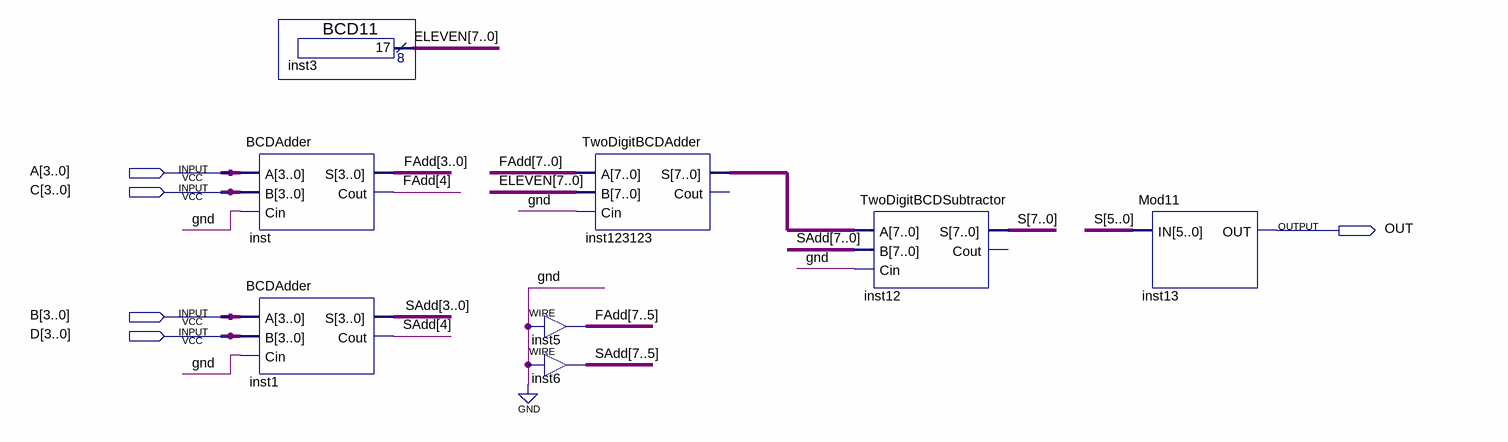
[diagram p0: schematic sheet]
// Quartus schematic FourDigitMod11.bdf as structural Verilog: 8 symbols, 5 pins
module FourDigitMod11 (
  input  [3:0] A,
  input  [3:0] C,
  input  [3:0] B,
  input  [3:0] D,
  output OUT
);

  wire [7:0] ELEVEN, FAdd, inst123123_s, S, SAdd;

  BCD11 inst3 (.result(ELEVEN));
  BCDAdder inst (.A(A), .B(C), .Cin(1'b0), .S(FAdd[3:0]), .Cout(FAdd[4]));
  BCDAdder inst1 (.A(B), .B(D), .Cin(1'b0), .S(SAdd[3:0]), .Cout(SAdd[4]));
  TwoDigitBCDAdder inst123123 (.A(FAdd), .B(ELEVEN), .Cin(1'b0), .S(inst123123_s));  // open: Cout
  assign FAdd[7:5] = 3'b000;  // WIRE inst5
  assign SAdd[7:5] = 3'b000;  // WIRE inst6
  TwoDigitBCDSubtractor inst12 (.A(inst123123_s), .B(SAdd), .Cin(1'b0), .S(S));  // open: Cout
  Mod11 inst13 (.IN(S[5:0]), .OUT(OUT));
endmodule
